# Altium schematic sheet Cover.SchDoc
size A3
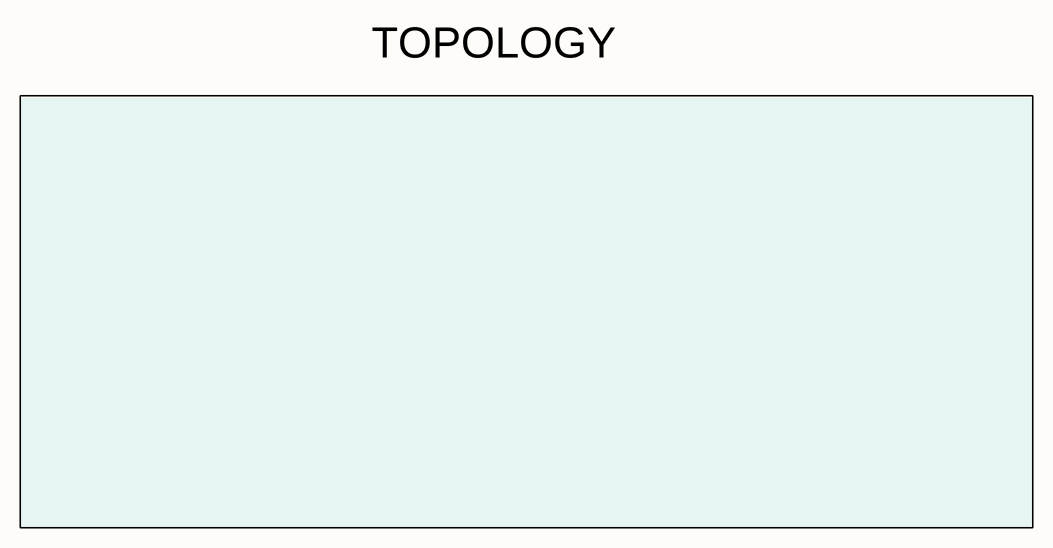
[diagram p0: Cover.SchDoc]

## Notes on the sheet
- TOPOLOGY
- Title:
- Project:
- Draw:
- Check:
- Revision:
- Sheet:
- of:
- File Name:
- Size:
- A3
- Modified Date:
- Time:
- Date: